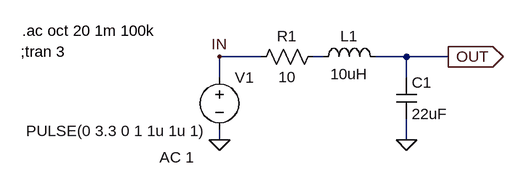
[diagram p0: schematic ArduinoLFO_RLC_LPF.asc]
ArduinoLFO_RLC_LPF.asc, the LTspice schematic file:
Version 4
SHEET 1 1028 680
WIRE 256 96 192 96
WIRE 352 96 336 96
WIRE 480 96 432 96
WIRE 544 96 480 96
WIRE 192 128 192 96
WIRE 480 128 480 96
WIRE 192 224 192 208
WIRE 480 224 480 192
FLAG 192 224 0
FLAG 192 96 IN
FLAG 480 224 0
FLAG 544 96 OUT
IOPIN 544 96 Out
SYMBOL voltage 192 112 R0
WINDOW 3 -298 98 Left 2
WINDOW 123 -92 139 Left 2
WINDOW 39 0 0 Left 2
SYMATTR InstName V1
SYMATTR Value PULSE(0 3.3 0 1 1u 1u 1)
SYMATTR Value2 AC 1
SYMBOL ind 336 112 R270
WINDOW 0 32 56 VTop 2
WINDOW 3 5 56 VBottom 2
SYMATTR InstName L1
SYMATTR Value 10uH
SYMBOL cap 464 128 R0
SYMATTR InstName C1
SYMATTR Value 22uF
SYMBOL res 352 80 R90
WINDOW 0 0 56 VBottom 2
WINDOW 3 32 56 VTop 2
SYMATTR InstName R1
SYMATTR Value 10
TEXT -114 88 Left 2 !;tran 3
TEXT -112 56 Left 2 !.ac oct 20 1m 100k

The netlist it stands for:
* ArduinoLFO_RLC_LPF.asc
V1 IN 0 PULSE(0 3.3 0 1 1u 1u 1) AC 1
L1 N001 OUT 10uH
C1 OUT 0 22uF
R1 N001 IN 10
;tran 3
.ac oct 20 1m 100k
.backanno
.end